# Altium schematic sheet Schematics V1.SchDoc
size A4; SheetNumber: 1; SheetTotal: 1
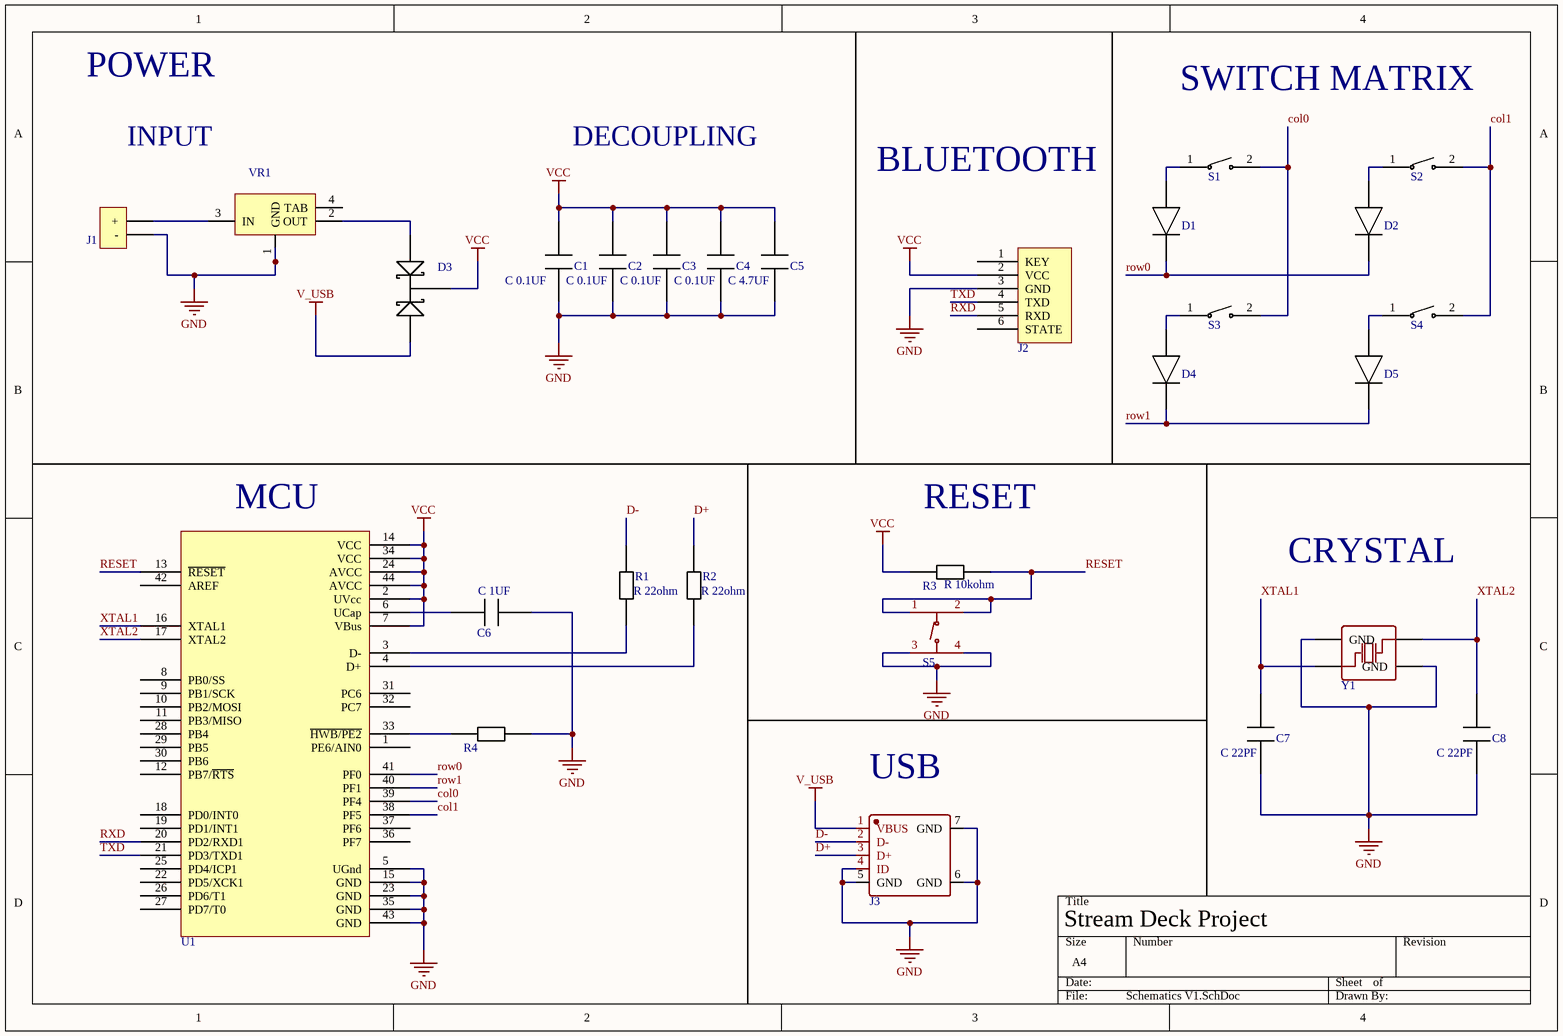
[diagram p0: Schematics V1.SchDoc]

## Parts
C1  C 0.1UF  [C0805]
C2  C 0.1UF  [C0805]
C3  C 0.1UF  [C0805]
C4  C 0.1UF  [C0805]
C5  C 4.7UF  [C0805]
C6  C 1UF  [C0805]
C7  C 22PF  [C0805]
C8  C 22PF  [C0805]
D1  Diode  [Diode]  (value not drawn)
D2  Diode  [Diode]  (value not drawn)
D3  Schottky  [SOT-23-3_L2.9-W1.6-P1.90-LS2.8-BR]  (value not drawn)
D4  Diode  [Diode]  (value not drawn)
D5  Diode  [Diode]  (value not drawn)
J1  BAT  [HDR-TH_2P-P2.54-V-M-1]  (value not drawn)
J2  HDR-Bluetooth  [HDR-TH_6P-P2.54-H-W8.6_A2541HWR-6P]  (value not drawn)
J3  USB  [USB-MINI-SMD_UX60SC-MB-5S8-80]  (value not drawn)
R1  R 22ohm  [R0805]
R2  R 22ohm  [R0805]
R3  R 10kohm  [R0805]
R4  R 10kohm  [R0805]  (value not drawn)
S1  Switch  [Mx_Alps_100]  (value not drawn)
S2  Switch  [Mx_Alps_100]  (value not drawn)
S3  Switch  [Mx_Alps_100]  (value not drawn)
S4  Switch  [Mx_Alps_100]  (value not drawn)
S5  Button  [SW-SMD_4P-L5.1-W5.1-P3.70-LS6.5-TL-2]  (value not drawn)
U1  MCU  [ATMEGA32U4]  (value not drawn)
VR1  Regulator  [SOT-223_L6.5-W3.5-P2.30-LS7.0-BR]  (value not drawn)
Y1  Crystal  [CRYSTAL-SMD_4P-L3.2-W2.5-BL]  (value not drawn)

## Nets
GND: C1.1 C2.1 C3.1 C4.1 C5.1 C6.2 C7.1 C8.1 J1.2(-) J2.3(GND) J3.4(ID) J3.5(GND) J3.6(GND) J3.7(GND) R4.2 S5.3(C) S5.4(D) U1.5(UGnd) U1.15(GND) U1.23(GND) U1.35(GND) U1.43(GND) VR1.1(GND) Y1.2(GND) Y1.4(GND)
V_USB: D3.1 J3.1(VBUS)
VCC: C1.2 C2.2 C3.2 C4.2 C5.2 D3.3 J2.2(VCC) R3.1 U1.2(UVcc) U1.7(VBus) U1.14(VCC) U1.24(AVCC) U1.34(VCC) U1.44(AVCC)
col0: S1.2 S3.2 U1.39(PF4)
col1: S2.2 S4.2 U1.38(PF5)
D+: J3.3(D+) R2.2
D-: J3.2(D-) R1.2
RESET: R3.2 S5.1(A) S5.2(B) U1.13(~{RESET})
row0: D1.1 D2.1 U1.41(PF0)
row1: D4.1 D5.1 U1.40(PF1)
RXD: J2.5(RXD) U1.20(PD2/RXD1)
TXD: J2.4(TXD) U1.21(PD3/TXD1)
XTAL1: C7.2 U1.16(XTAL1) Y1.1(OSC1)
XTAL2: C8.2 U1.17(XTAL2) Y1.3(OSC2)
NetC6_1: C6.1 U1.6(UCap)
NetD1_2: D1.2 S1.1
NetD2_2: D2.2 S2.1
NetD3_2: D3.2 VR1.2(OUT)
NetD4_2: D4.2 S3.1
NetD5_2: D5.2 S4.1
NetJ1_1: J1.1(+) VR1.3(IN)
NetR1_1: R1.1 U1.3(D-)
NetR2_1: R2.1 U1.4(D+)
NetR4_1: R4.1 U1.33(~{HWB/PE2})

Not connected (* = marked no-connect by the designer): J2 1(KEY) 6(STATE); U1 1(PE6/AIN0) 8(PB0/SS) 9(PB1/SCK) 10(PB2/MOSI) 11(PB3/MISO) 12(PB7/~{RTS}) 18(PD0/INT0) 19(PD1/INT1) 22(PD5/XCK1) 25(PD4/ICP1) 26(PD6/T1) 27(PD7/T0) 28(PB4) 29(PB5) 30(PB6) 31(PC6) 32(PC7) 36(PF7) 37(PF6) 42(AREF); VR1 4(TAB)

## Notes on the sheet
- POWER
- SWITCH MATRIX
- INPUT
- DECOUPLING
- BLUETOOTH
- (near U1) MCU
- RESET
- CRYSTAL
- (near J3) USB
- Stream Deck Project

## Library data of the parts
C1-C4 = CL21C101JBANNNC: CAP CER 100PF 50V C0G/NP0 0805; Manufacturer: Samsung; Material: Ceramic; Tolerance: 5%; Dielectric: C0G; Temperature Coefficient: 300ppm/°C; Supplier 1: Digi-Key; Manufacturer Part Number: CL21C101JBANNNC; RoHS: Yes; Category: Ceramic Capacitors; Stock 1: 15526; Pricing 1: 1=0.10000, 10=0.05400, 50=0.02940, 100=0.02410, 500=0.01718, 1000=0.01350 (USD); Mount: Surface Mount; Case/Package: 0805; Case Code (Metric): 2012; Case Code (Imperial): 0805; Contact Plating: Tin; Min Operating Temperature: -55°C; Max Operating Temperature: 125°C; Capacitance: 100pF; Voltage: 50V; Voltage Rating (DC): 50V; Voltage Rating: 50V; Packaging: Tape and Reel; Series: CL; Construction: Flat; Length: 2mm; Width: 0.049inch; Height: 0.65mm; Depth: 1.25mm; Thickness: 0.03inch; Radiation Hardening: No; Lead Free: Lead Free; RoHS Compliant: Yes; ComponentLink1URL: https://datasheet.ciiva.com/25710/cl21c101jbannnc-25710193.pdf?src-supplier=Digi-Key; ComponentLink1Description: https://datasheet.ciiva.com/25710/cl21c101jbannnc-25710193.pdf?src-supplier=Digi-Key; ComponentLink2URL: https://datasheet.ciiva.com/29199/454082-da-01-en-vs-kondensator-0805-29199900.pdf?src-supplier=Conrad; ComponentLink2Description: https://datasheet.ciiva.com/29199/454082-da-01-en-vs-kondensator-0805-29199900.pdf?src-supplier=Conrad; Supplier Part Number 1: 1276-1014-1-ND
C5 = CL21A475KAQNNNE: SAMSUNG ELECTRO-MECHANICS - CL21A475KAQNNNE - SMD Multilayer Ceramic Capacitor, 4.7 µF, 25 V, 0805 [2012 Metric], ± 10%, X5R, CL Series; Voltage Rating: 25V; Supplier 1: Digi-Key; Manufacturer: Samsung; Manufacturer Part Number: CL21A475KAQNNNE; RoHS: Yes; Category: Ceramic Capacitors; Pricing 1: 1=0.12000, 10=0.08300, 50=0.04700, 100=0.03890, 500=0.02728, 1000=0.02259 (USD); Mount: Surface Mount; Case/Package: 0805; Case Code (Metric): 2012; Case Code (Imperial): 0805; Min Operating Temperature: -55°C; Max Operating Temperature: 85°C; Package Quantity: 1; Packaging: Tape and Reel; Capacitance: 4.7uF; Tolerance: 10%; Dielectric: X5R; Voltage Rating (DC): 25V; Series: CL; Construction: Flat; Length: 2mm; Width: 0.049inch; Height: 1.25mm; Thickness: 0.055inch; Depth: 1.25mm; Radiation Hardening: No; Lead Free: Lead Free; RoHS Compliant: Yes; ComponentLink1URL: https://datasheet.ciiva.com/25798/cl21a475kaqnnne-25798882.pdf?src-supplier=Digi-Key; ComponentLink1Description: https://datasheet.ciiva.com/25798/cl21a475kaqnnne-25798882.pdf?src-supplier=Digi-Key; Supplier Part Number 1: 1276-1244-1-ND
C6 = CL21B105KBFNNNE: SAMSUNG ELECTRO-MECHANICS - CL21B105KBFNNNE - SMD Multilayer Ceramic Capacitor, 1 µF, 50 V, 0805 [2012 Metric], ± 10%, X7R, CL Series; Voltage Rating: 50V; Supplier 1: Digi-Key; Manufacturer: Samsung; Manufacturer Part Number: CL21B105KBFNNNE; RoHS: Yes; Category: Ceramic Capacitors; Pricing 1: 1=0.13000, 10=0.09000, 50=0.05120, 100=0.04250, 500=0.02978, 1000=0.02465 (USD); Mount: Surface Mount; Case/Package: 0805; Case Code (Metric): 2012; Case Code (Imperial): 0805; Min Operating Temperature: -55°C; Max Operating Temperature: 125°C; Tolerance: 10%; Packaging: Tape and Reel; Package Quantity: 1; Capacitance: 1uF; Dielectric: X7R; Voltage: 50V; Series: CL; Construction: Flat; Length: 2mm; Width: 0.049inch; Height: 1.25mm; Thickness: 0.053inch; Depth: 1.25mm; Radiation Hardening: No; RoHS Compliant: Yes; ComponentLink1URL: https://datasheet.ciiva.com/25800/cl21b105kbfnnne-25800291.pdf?src-supplier=Digi-Key; ComponentLink1Description: https://datasheet.ciiva.com/25800/cl21b105kbfnnne-25800291.pdf?src-supplier=Digi-Key; ComponentLink2URL: https://datasheet.ciiva.com/16449/cl21b105kbfnnne-16449003.pdf?src-supplier=Future+Electronics; ComponentLink2Description: https://datasheet.ciiva.com/16449/cl21b105kbfnnne-16449003.pdf?src-supplier=Future+Electronics; ComponentLink3URL: https://datasheet.ciiva.com/26838/getdatasheetpartid-354075-26838668.pdf?src-supplier=Verical; ComponentLink3Description: https://datasheet.ciiva.com/26838/getdatasheetpartid-354075-26838668.pdf?src-supplier=Verical; Supplier Part Number 1: 1276-1029-1-ND
C7 C8 = CL21C220JBANNNC: Cap Ceramic 22pF 50V C0G 5% SMD 0805 125C T/R; Manufacturer: Samsung; Temperature Coefficient: 300ppm/°C; Supplier 1: Digi-Key; Manufacturer Part Number: CL21C220JBANNNC; RoHS: Yes; Category: Ceramic Capacitors; Stock 1: 65406; Pricing 1: 1=0.10000, 10=0.05400, 50=0.02940, 100=0.02390, 500=0.01710, 1000=0.01344 (USD); Mount: Surface Mount; Case/Package: 0805; Case Code (Metric): 2012; Case Code (Imperial): 0805; Contact Plating: Tin; Material: Ceramic; Min Operating Temperature: -55°C; Max Operating Temperature: 125°C; Tolerance: 5%; Capacitance: 22pF; Dielectric: C0G; Voltage Rating (DC): 50V; Packaging: Tape and Reel; Package Quantity: 1; Voltage Rating: 50V; Voltage: 50V; Length: 2mm; Width: 0.049inch; Height: 0.65mm; Depth: 1.25mm; Thickness: 0.03inch; Radiation Hardening: No; Lead Free: Lead Free; ComponentLink1URL: https://datasheet.ciiva.com/25801/cl21c220jbannnc-25801668.pdf?src-supplier=Digi-Key; ComponentLink1Description: https://datasheet.ciiva.com/25801/cl21c220jbannnc-25801668.pdf?src-supplier=Digi-Key; ComponentLink2URL: https://datasheet.ciiva.com/15227/getdatasheetpartid-355345-15227198.pdf?src-supplier=Verical; ComponentLink2Description: https://datasheet.ciiva.com/15227/getdatasheetpartid-355345-15227198.pdf?src-supplier=Verical; ComponentLink3URL: https://datasheet.ciiva.com/29199/454687-da-01-en-vs-kondensator-0805-29199501.pdf?src-supplier=Conrad; ComponentLink3Description: https://datasheet.ciiva.com/29199/454687-da-01-en-vs-kondensator-0805-29199501.pdf?src-supplier=Conrad; ComponentLink4URL: https://datasheet.ciiva.com/16387/cl05b104kq5nnnc-16387287.pdf?src-supplier=Future+Electronics; ComponentLink4Description: https://datasheet.ciiva.com/16387/cl05b104kq5nnnc-16387287.pdf?src-supplier=Future+Electronics; Supplier Part Number 1: 1276-1047-1-ND
D1 D2 D4 D5 = 1N4148W-TP: MICRO COMMERCIAL COMPONENTS - 1N4148W-TP - SWITCHING DIODE, 150mA, 100V, SOD123, FU; Manufacturer: MCC; Max Surge Current: 2A; Forward Voltage: 1V; Recovery Time: 4ns; Max Reverse Leakage Current: 5uA; Power Dissipation: 400mW; Max Forward Surge Current (Ifsm): 1A; Element Configuration: Single; Polarity: Standard; Capacitance: 4pF; Supplier 1: Digi-Key; Manufacturer Part Number: 1N4148W-TP; RoHS: Yes; Category: Rectifier Diodes; Stock 1: 295290; Pricing 1: 1=0.19000, 10=0.17300, 100=0.09440, 500=0.05808, 1000=0.03960 (USD); Mount: Surface Mount; Number of Pins: 2; Min Operating Temperature: -65°C; Max Operating Temperature: 150°C; Packaging: Tape and Reel; Forward Current: 150mA; Package Quantity: 3000; Average Rectified Current: 150mA; Reverse Recovery Time: 4ns; Max Repetitive Reverse Voltage (Vrrm): 100V; Peak Non-Repetitive Surge Current: 2A; Voltage Rating (DC): 100V; Current Rating: 150mA; Output Current: 150mA; Max Reverse Voltage (DC): 100V; Length: 2.85mm; Width: 1.8mm; Height: 1.2mm; Radiation Hardening: No; REACH SVHC: Unknown; Lead Free: Lead Free; ComponentLink1URL: https://datasheet.ciiva.com/1243/1684829-1243908.pdf?src-supplier=Newark; ComponentLink1Description: https://datasheet.ciiva.com/1243/1684829-1243908.pdf?src-supplier=Newark; ComponentLink2URL: https://datasheet.ciiva.com/16836/1n4148wsod123-16836277.pdf?src-supplier=Future+Electronics; ComponentLink2Description: https://datasheet.ciiva.com/16836/1n4148wsod123-16836277.pdf?src-supplier=Future+Electronics; ComponentLink3URL: https://datasheet.ciiva.com/4435/1n4148wsod123-48460-4435223.pdf?src-supplier=Mouser; ComponentLink3Description: https://datasheet.ciiva.com/4435/1n4148wsod123-48460-4435223.pdf?src-supplier=Mouser; ComponentLink4URL: https://datasheet.ciiva.com/14557/70055519-14557767.pdf?src-supplier=Allied+Electronics; ComponentLink4Description: https://datasheet.ciiva.com/14557/70055519-14557767.pdf?src-supplier=Allied+Electronics; ComponentLink5URL: https://datasheet.ciiva.com/911/1n4148wsod123-911676.pdf?src-supplier=Digi-Key; ComponentLink5Description: https://datasheet.ciiva.com/911/1n4148wsod123-911676.pdf?src-supplier=Digi-Key; ComponentLink6URL: https://datasheet.ciiva.com/7622/1684829-7622556.pdf?src-supplier=Element14; ComponentLink6Description: https://datasheet.ciiva.com/7622/1684829-7622556.pdf?src-supplier=Element14; ComponentLink7URL: https://datasheet.ciiva.com/911/1n4148wsod123-911677.pdf?src-supplier=Digi-Key; ComponentLink7Description: https://datasheet.ciiva.com/911/1n4148wsod123-911677.pdf?src-supplier=Digi-Key; ComponentLink8URL: https://datasheet.ciiva.com/911/1n4148wsod123-911678.pdf?src-supplier=Digi-Key; ComponentLink8Description: https://datasheet.ciiva.com/911/1n4148wsod123-911678.pdf?src-supplier=Digi-Key; ComponentLink9URL: https://datasheet.ciiva.com/22747/1684829-22747439.pdf?src-supplier=Element14; ComponentLink9Description: https://datasheet.ciiva.com/22747/1684829-22747439.pdf?src-supplier=Element14; Supplier Part Number 1: 1N4148WTPMSCT-ND
D3 = BAT54CLT1G: Diode Schottky 30V 0.2A 3-Pin SOT-23 T/R; Manufacturer: ON Semiconductor; Forward Current: 200mA; Element Configuration: Common Cathode; Max Power Dissipation: 225mW; Recovery Time: 5ns; Max Reverse Leakage Current: 2uA; Peak Non-Repetitive Surge Current: 600mA; Capacitance: 10pF; Forward Voltage: 800mV; Supplier 1: Digi-Key; Manufacturer Part Number: BAT54CLT1G; RoHS: Yes; Category: Schottky Diodes; Pricing 1: 1=0.17000, 10=0.15600, 100=0.08490, 500=0.05224, 1000=0.03562 (USD); Case/Package: SOT-23-3; Number of Pins: 3; Contact Plating: Tin,Matte; Min Operating Temperature: -55°C; Max Operating Temperature: 125°C; Packaging: Tape and Reel; Package Quantity: 3000; Average Rectified Current: 200mA; Reverse Recovery Time: 5ns; Max Repetitive Reverse Voltage (Vrrm): 30V; Max Forward Surge Current (Ifsm): 600mA; Current Rating: 200mA; Voltage Rating (DC): 30V; Max Reverse Voltage (DC): 30V; Max Surge Current: 600mA; Max Reverse Current: 2uA; Power Dissipation: 225mW; Length: 3.04mm; Width: 1.4mm; Height: 1.01mm; Radiation Hardening: No; Lead Free: Lead Free; Halogen Free: Halogen Free; REACH SVHC: No SVHC; ComponentLink1URL: https://datasheet.ciiva.com/1240/bat54clt1-d-1240707.pdf?src-supplier=Newark; ComponentLink1Description: https://datasheet.ciiva.com/1240/bat54clt1-d-1240707.pdf?src-supplier=Newark; ComponentLink2URL: https://datasheet.ciiva.com/30479/0900766b8121b932-30479128.pdf?src-supplier=RSComponents; ComponentLink2Description: https://datasheet.ciiva.com/30479/0900766b8121b932-30479128.pdf?src-supplier=RSComponents; ComponentLink3URL: https://datasheet.ciiva.com/34301/885769-34301654.pdf?src-supplier=Jameco; ComponentLink3Description: https://datasheet.ciiva.com/34301/885769-34301654.pdf?src-supplier=Jameco; ComponentLink4URL: https://datasheet.ciiva.com/15144/getdatasheetpartid-98336-15144809.pdf?src-supplier=Verical; ComponentLink4Description: https://datasheet.ciiva.com/15144/getdatasheetpartid-98336-15144809.pdf?src-supplier=Verical; ComponentLink5URL: https://datasheet.ciiva.com/1180/bat54clt1-d-1180248.pdf?src-supplier=Element14; ComponentLink5Description: https://datasheet.ciiva.com/1180/bat54clt1-d-1180248.pdf?src-supplier=Element14; ComponentLink6URL: https://datasheet.ciiva.com/1180/bat54clt1-d-1180247.pdf?src-supplier=Element14; ComponentLink6Description: https://datasheet.ciiva.com/1180/bat54clt1-d-1180247.pdf?src-supplier=Element14; ComponentLink7URL: https://datasheet.ciiva.com/22659/1918740-22659014.pdf?src-supplier=Element14; ComponentLink7Description: https://datasheet.ciiva.com/22659/1918740-22659014.pdf?src-supplier=Element14; ComponentLink8URL: https://datasheet.ciiva.com/28655/bat54clt1-d-28655787.pdf?src-supplier=Element14; ComponentLink8Description: https://datasheet.ciiva.com/28655/bat54clt1-d-28655787.pdf?src-supplier=Element14; ComponentLink9URL: https://datasheet.ciiva.com/8294/bat54clt1-d-8294495.pdf?src-supplier=Avnet; ComponentLink9Description: https://datasheet.ciiva.com/8294/bat54clt1-d-8294495.pdf?src-supplier=Avnet; ComponentLink10URL: https://datasheet.ciiva.com/16205/bat54clt1-d-16205033.pdf?src-supplier=Future+Electronics; ComponentLink10Description: https://datasheet.ciiva.com/16205/bat54clt1-d-16205033.pdf?src-supplier=Future+Electronics; ComponentLink11URL: https://datasheet.ciiva.com/905/bat54clt1-d-905835.pdf?src-supplier=Digi-Key; ComponentLink11Description: https://datasheet.ciiva.com/905/bat54clt1-d-905835.pdf?src-supplier=Digi-Key; Supplier Part Number 1: BAT54CLT1GOSCT-ND
J1 = 22-28-4020: CONN HEADER VERT 2POS 2.54MM; Manufacturer: Molex; Number of Contacts: 2; Current Rating: 4A; Voltage Rating: 250V; Gender: Male; Contact Resistance: 20mR; Connector Type: Male Pin; Glow Wire Compliant: Non-compliant; Supplier 1: Digi-Key; Manufacturer Part Number: 22-28-4020; RoHS: Yes; Category: Headers and Wire Housings; Stock 1: 2565; Pricing 1: 1=0.12000, 10=0.08200, 100=0.05890 (USD); Mount: Through Hole; Contact Plating: Tin; Contact Material: Brass,Bronze; Housing Material: Nylon; Color: Black; Housing Color: Black; Min Operating Temperature: 0°C; Max Operating Temperature: 75°C; Number of Rows: 1; Termination: Solder; Orientation: Straight; Package Quantity: 1; Packaging: Bulk; Max Voltage Rating (DC): 250V; Number of Positions: 2; Voltage Rating (DC): 250V; Number of Circuits: 2; Series: KK® 42375; Contact Type: Male Pin; Max Voltage Rating (AC): 250V; Pitch: 2.54mm; Contact Mating Length: 0.24inch; Depth: 2.49mm; Radiation Hardening: No; REACH SVHC: Unknown; Lead Free: Lead Free; Flammability Rating: UL94 V-0; ComponentLink1URL: https://datasheet.ciiva.com/1433/1596842-1433683.pdf?src-supplier=Element14; ComponentLink1Description: https://datasheet.ciiva.com/1433/1596842-1433683.pdf?src-supplier=Element14; ComponentLink2URL: https://datasheet.ciiva.com/30153/214440022284020-pcb-headers-30153261.pdf?src-supplier=Onlinecomponents.com; ComponentLink2Description: https://datasheet.ciiva.com/30153/214440022284020-pcb-headers-30153261.pdf?src-supplier=Onlinecomponents.com; ComponentLink3URL: https://datasheet.ciiva.com/16658/0022284020-pcb-headers-16658182.pdf?src-supplier=Avnet+Europe; ComponentLink3Description: https://datasheet.ciiva.com/16658/0022284020-pcb-headers-16658182.pdf?src-supplier=Avnet+Europe; ComponentLink4URL: https://datasheet.ciiva.com/5157/0022284020-pcb-headers-228358-5157523.pdf?src-supplier=Mouser; ComponentLink4Description: https://datasheet.ciiva.com/5157/0022284020-pcb-headers-228358-5157523.pdf?src-supplier=Mouser; ComponentLink5URL: https://datasheet.ciiva.com/15217/getdatasheetpartid-127875-15217702.pdf?src-supplier=Verical; ComponentLink5Description: https://datasheet.ciiva.com/15217/getdatasheetpartid-127875-15217702.pdf?src-supplier=Verical; ComponentLink6URL: https://datasheet.ciiva.com/10088/0022284020-pcb-headers-10088332.pdf?src-supplier=Avnet; ComponentLink6Description: https://datasheet.ciiva.com/10088/0022284020-pcb-headers-10088332.pdf?src-supplier=Avnet; ComponentLink7URL: https://datasheet.ciiva.com/49385/879406-49385687.pdf?src-supplier=Jameco; ComponentLink7Description: https://datasheet.ciiva.com/49385/879406-49385687.pdf?src-supplier=Jameco; Supplier Part Number 1: WM50014-02-ND
J2 = A2541HWR-6P: Manufacturer: CJT Connectors; Supplier 1: LCSC; Manufacturer Part Number: A2541HWR-6P; RoHS: No; Category: Uncategorized; Supplier Part Number 1: C225514; Stock 1: 3270; Pricing 1: 1=1.41510, 10=1.13220, 30=1.08030, 100=1.02830, 500=1.00520, 1000=0.99380, 1=1.36720, 10=1.09390, 30=1.04380, 100=0.99360, 500=0.97130, 1000=0.96020, 1=7.15180, 10=5.72210, 30=5.46000, 100=5.19730, 500=5.08050, 1000=5.02280, 1=6.79030, 10=5.43280, 30=5.18400, 100=4.93460, 500=4.82370, 1000=4.76890, 1=0.91320, 10=0.73070, 30=0.69720, 100=0.66370, 500=0.64870, 1000=0.64140, 1=0.79380, 10=0.63510, 30=0.60600, 100=0.57690, 500=0.56390, 1000=0.55750, 1=8.55700, 10=6.84640, 30=6.53280, 100=6.21850, 500=6.07880, 1000=6.00970, 1=119.38420, 10=95.51820, 30=91.14350, 100=86.75790, 500=84.80880, 1000=83.84510, 1=4.51910, 10=3.61570, 30=3.45010, 100=3.28410, 500=3.21030, 1000=3.17390, 1=82.66820, 10=66.14210, 30=63.11280, 100=60.07600, 500=58.72630, 1000=58.05890, 1=9.24660, 10=7.39810, 30=7.05930, 100=6.71960, 500=6.56860, 1000=6.49400, 1=1.46250, 10=1.17010, 30=1.11650, 100=1.06280, 500=1.03890, 1000=1.02710, 1=1.10250, 10=0.88210, 30=0.84170, 100=0.80120, 500=0.78320, 1000=0.77430 (AUD)
J3 = UX60SC-MB-5S8(80): CONN RCPT MINI USB2.0 5POS; Manufacturer: Hirose; Gender: Receptacle; Voltage Rating: 30V; Current Rating: 1A; Number of Contacts: 5; Supplier 1: Digi-Key; Manufacturer Part Number: UX60SC-MB-5S8(80); RoHS: Yes; Category: Connectors; Stock 1: 3000; Pricing 1: 1=0.75000, 10=0.66300, 25=0.62400, 50=0.59800, 100=0.57200, 250=0.52000, 500=0.46800 (USD); Mount: Surface Mount,Horizontal,Through Hole; Contact Material: Copper Alloy; Min Operating Temperature: -30°C; Max Operating Temperature: 75°C; Package Quantity: 1000; Packaging: Tape and Reel; Connector Type: USB; Termination: Solder; Orientation: Right Angle; Series: UX60S; RoHS Compliant: Yes; ComponentLink1URL: https://datasheet.ciiva.com/22825/0900766b8118eafc-22825831.pdf?src-supplier=RSComponents; ComponentLink1Description: https://datasheet.ciiva.com/22825/0900766b8118eafc-22825831.pdf?src-supplier=RSComponents; ComponentLink2URL: https://datasheet.ciiva.com/18563/ux60s-18563943.pdf?src-supplier=Digi-Key; ComponentLink2Description: https://datasheet.ciiva.com/18563/ux60s-18563943.pdf?src-supplier=Digi-Key; Supplier Part Number 1: H125762CT-ND
R1 R2 = 0805W8F220JT5E: ±1% ±200ppm/℃ 22Ω 0.125W 0805 Chip Resistor - Surface Mount ROHS; Manufacturer: Uniroyal; Supplier 1: LCSC; Manufacturer Part Number: 0805W8F220JT5E; RoHS: Yes; Supplier Part Number 1: C17561
R3 R4 = 0805W8F1002T5E: ±1% ±100ppm/℃ 10kΩ 0.125W 0805 Chip Resistor - Surface Mount ROHS; Manufacturer: Uniroyal; Supplier 1: LCSC; Manufacturer Part Number: 0805W8F1002T5E; RoHS: Yes; RoHS Compliant: Yes; Supplier Part Number 1: C17414
S5 = TS-1187A-B-A-B: Manufacturer: XKB Connectivity; Supplier 1: LCSC; Manufacturer Part Number: TS-1187A-B-A-B; RoHS: No; Category: Uncategorized; Supplier Part Number 1: C318884
U1 = ATMEGA32U4-AU: MCU 8-bit ATmega AVR RISC 32KB Flash 3.3V/5V 44-Pin TQFP; Manufacturer: Microchip / Atmel; Interface: SPI,USART,I2C,USB,UART,I2S; Number of I/Os: 26; Data Bus Width: 8b; Oscillator Type: External; Peripherals: Brown-out Detect/Reset,POR,PWM,WDT; Min Supply Voltage: 2.7V; Max Supply Voltage: 5.5V; RAM Size: 2.5KB; Number of Timers/Counters: 5; Frequency: 16MHz; Watchdog Timer: Yes; Number of PWM Channels: 8; Number of ADC Channels: 12; Number of SPI Channels: 1; Supplier 1: Digi-Key; Manufacturer Part Number: ATMEGA32U4-AU; RoHS: Yes; Category: Microcontrollers; Pricing 1: 1=4.83000, 25=4.41600, 100=4.01350 (USD); Mount: Surface Mount; Case/Package: TQFP; Number of Pins: 44; Min Operating Temperature: -40°C; Max Operating Temperature: 85°C; Core Architecture: AVR; Packaging: Tray; Memory Type: FLASH; Memory Size: 32KB; Package Quantity: 800; Number of Programmable I/O: 26; Max Frequency: 16MHz; Series: AVR® ATmega; Number of I2C Channels: 1; Length: 10mm; Width: 10mm; Height: 1.05mm; Radiation Hardening: No; REACH SVHC: No SVHC; Lead Free: Lead Free; ComponentLink1URL: https://datasheet.ciiva.com/22651/1684411-22651233.pdf?src-supplier=Farnell; ComponentLink1Description: https://datasheet.ciiva.com/22651/1684411-22651233.pdf?src-supplier=Farnell; ComponentLink2URL: https://datasheet.ciiva.com/4842/doc7766-31808-4842466.pdf?src-supplier=Mouser; ComponentLink2Description: https://datasheet.ciiva.com/4842/doc7766-31808-4842466.pdf?src-supplier=Mouser; ComponentLink3URL: https://datasheet.ciiva.com/15122/getdatasheetpartid-116246-15122378.pdf?src-supplier=Verical; ComponentLink3Description: https://datasheet.ciiva.com/15122/getdatasheetpartid-116246-15122378.pdf?src-supplier=Verical; ComponentLink4URL: https://datasheet.ciiva.com/26817/atmega32u4-au-26817829.pdf?src-supplier=IIIC; ComponentLink4Description: https://datasheet.ciiva.com/26817/atmega32u4-au-26817829.pdf?src-supplier=IIIC; ComponentLink5URL: https://datasheet.ciiva.com/1157/1684411-1157762.pdf?src-supplier=Element14; ComponentLink5Description: https://datasheet.ciiva.com/1157/1684411-1157762.pdf?src-supplier=Element14; Supplier Part Number 1: ATMEGA32U4-AU-ND
VR1 = AMS1117-5.0: Manufacturer: Advanced Monolithic Systems; Supplier 1: LCSC; Manufacturer Part Number: AMS1117-5.0; RoHS: Yes; Stock 1: 41515; Case/Package: Module; Supplier Part Number 1: C6187; Pricing 1: 1=1.19980, 10=0.91640, 30=0.86440, 100=0.81230, 500=0.78920, 1000=0.77780, 1=1.15930, 10=0.88550, 30=0.83520, 100=0.78490, 500=0.76260, 1000=0.75150, 1=6.06400, 10=4.63160, 30=4.36890, 100=4.10560, 500=3.98880, 1000=3.93110, 1=5.75740, 10=4.39750, 30=4.14810, 100=3.89800, 500=3.78720, 1000=3.73230, 1=0.77430, 10=0.59140, 30=0.55790, 100=0.52430, 500=0.50930, 1000=0.50200, 1=0.67310, 10=0.51410, 30=0.48490, 100=0.45570, 500=0.44270, 1000=0.43630, 1=7.25540, 10=5.54170, 30=5.22730, 100=4.91220, 500=4.77250, 1000=4.70340, 1=101.22480, 10=77.31550, 30=72.92990, 100=68.53360, 500=66.58440, 1000=65.62070, 1=3.83170, 10=2.92670, 30=2.76070, 100=2.59430, 500=2.52050, 1000=2.48400, 1=70.09360, 10=53.53750, 30=50.50070, 100=47.45640, 500=46.10670, 1000=45.43940, 1=7.84010, 10=5.98830, 30=5.64860, 100=5.30810, 500=5.15710, 1000=5.08250, 1=1.24000, 10=0.94710, 30=0.89340, 100=0.83960, 500=0.81570, 1000=0.80390, 1=0.93480, 10=0.71400, 30=0.67350, 100=0.63290, 500=0.61490, 1000=0.60600 (AUD)
Y1 = X1E0000210264: Manufacturer: Seiko; Supplier 1: LCSC; Manufacturer Part Number: X1E0000210264; RoHS: No; Supplier Part Number 1: C91744